# Altium project memori_pcb.PrjPcb
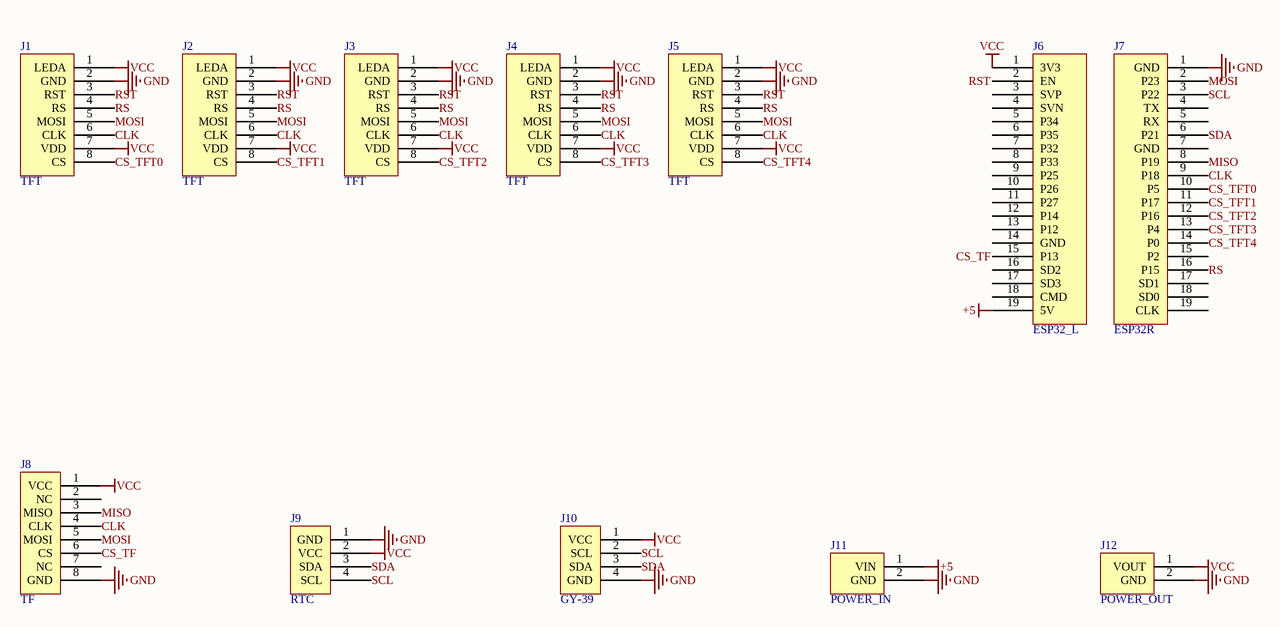
[diagram p0: 原理图.SchDoc]
1 sheet, 12 parts. Net scope: global (net labels, ports and power ports of the same name join across sheets).
Board file: PCB.PcbDoc

## Sheet 原理图.SchDoc
size A4

### Parts
J1  TFT  [MHDR1X8]
J2  TFT  [MHDR1X8]
J3  TFT  [MHDR1X8]
J4  TFT  [MHDR1X8]
J5  TFT  [MHDR1X8]
J6  ESP32_L  [MHDR1X19]
J7  ESP32R  [MHDR1X19]
J8  TF  [MHDR1X8]
J9  RTC  [MHDR1X4]
J10  GY-39  [MHDR1X4]
J11  POWER_IN  [MHDR1X2]
J12  POWER_OUT  [MHDR1X2]

### Nets
+5: J6.19(5V) J11.1(VIN)
GND: J1.2(GND) J2.2(GND) J3.2(GND) J4.2(GND) J5.2(GND) J7.1(GND) J8.8(GND) J9.1(GND) J10.4(GND) J11.2(GND) J12.2(GND)
VCC: J1.1(LEDA) J1.7(VDD) J2.1(LEDA) J2.7(VDD) J3.1(LEDA) J3.7(VDD) J4.1(LEDA) J4.7(VDD) J5.1(LEDA) J5.7(VDD) J6.1(3V3) J8.1(VCC) J9.2(VCC) J10.1(VCC) J12.1(VOUT)
CLK: J1.6(CLK) J2.6(CLK) J3.6(CLK) J4.6(CLK) J5.6(CLK) J7.9(P18) J8.4(CLK)
CS_TF: J6.15(P13) J8.6(CS)
CS_TFT0: J1.8(CS) J7.10(P5)
CS_TFT1: J2.8(CS) J7.11(P17)
CS_TFT2: J3.8(CS) J7.12(P16)
CS_TFT3: J4.8(CS) J7.13(P4)
CS_TFT4: J5.8(CS) J7.14(P0)
MISO: J7.8(P19) J8.3(MISO)
MOSI: J1.5(MOSI) J2.5(MOSI) J3.5(MOSI) J4.5(MOSI) J5.5(MOSI) J7.2(P23) J8.5(MOSI)
RS: J1.4(RS) J2.4(RS) J3.4(RS) J4.4(RS) J5.4(RS) J7.16(P15)
RST: J1.3(RST) J2.3(RST) J3.3(RST) J4.3(RST) J5.3(RST) J6.2(EN)
SCL: J7.3(P22) J9.4(SCL) J10.2(SCL)
SDA: J7.6(P21) J9.3(SDA) J10.3(SDA)

Not connected (* = marked no-connect by the designer): J6 3(SVP) 4(SVN) 5(P34) 6(P35) 7(P32) 8(P33) 9(P25) 10(P26) 11(P27) 12(P14) 13(P12) 14(GND) 16(SD2) 17(SD3) 18(CMD); J7 4(TX) 5(RX) 7(GND) 15(P2) 17(SD1) 18(SD0) 19(CLK); J8 2(NC) 7(NC)

### Library data of the parts
J1-J5 = 1.14 tft: TFT槽
J6 = ESP32-S_L: ESP32左槽
J7 = ESP32-S_R: ESP32右槽
J8 = TF card: TF卡模块槽
J9 = RTC: 时钟模块槽
J10 = GY-39: GY-39模块槽